# Altium schematic sheet 6_din.SchDoc: Digital Inputs
size A4; DocumentNumber: 7; SheetNumber: 7; SheetTotal: 11
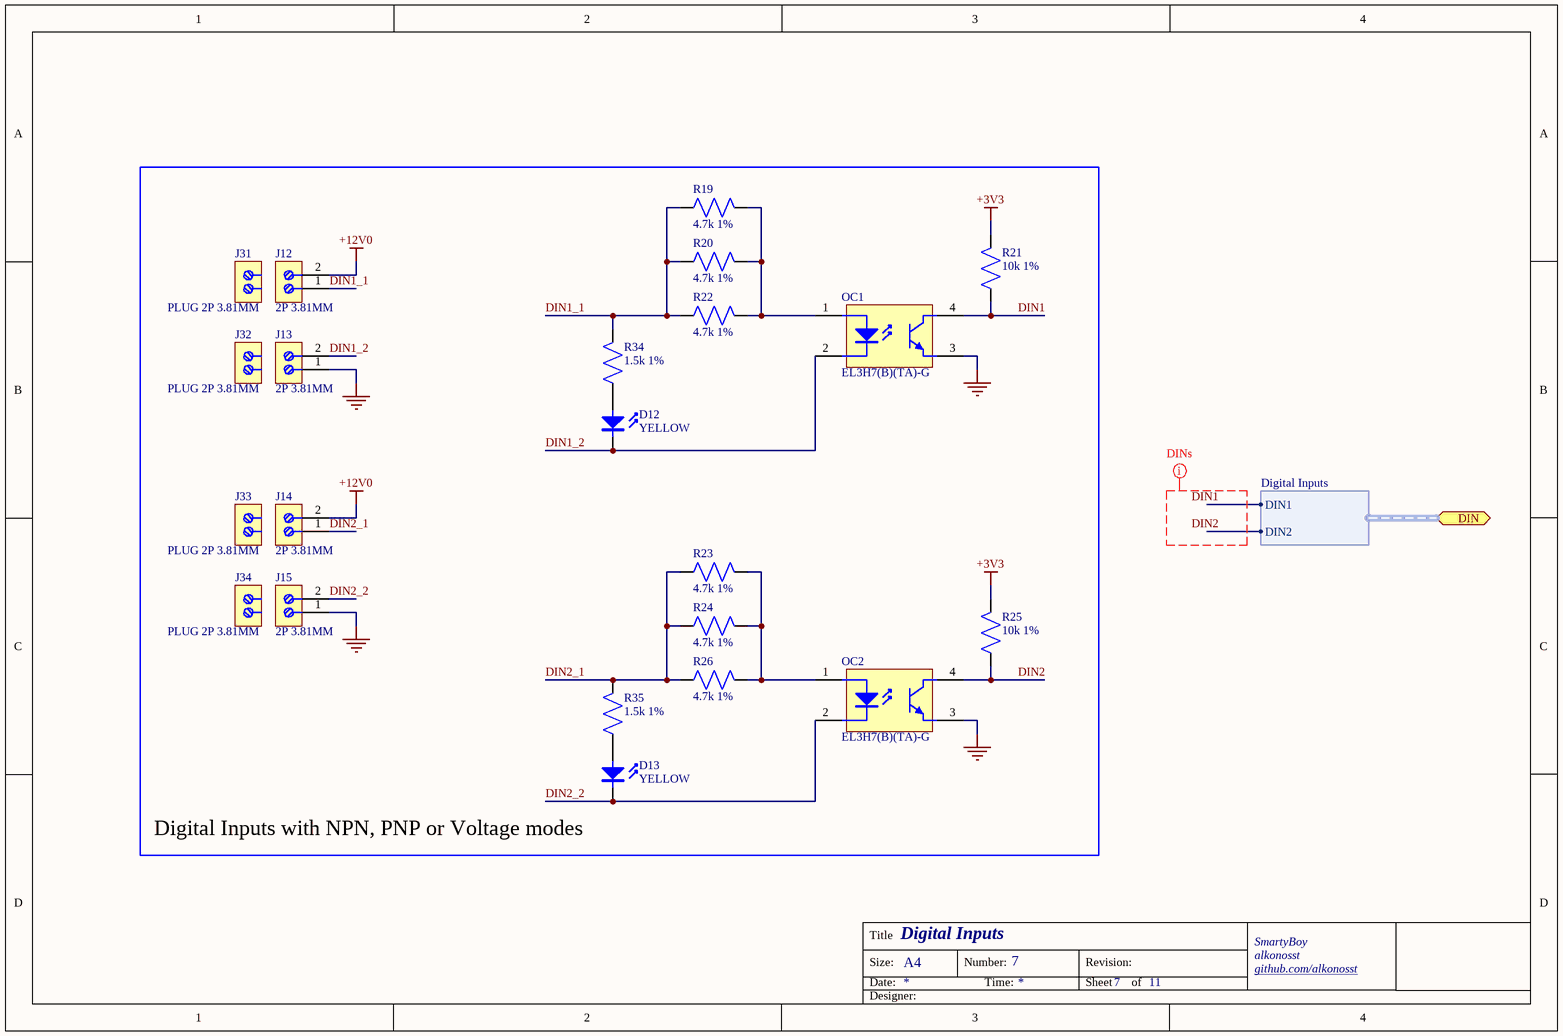
[diagram p0: 6_din.SchDoc]

## Parts
D12  YELLOW  [LED0603-YELLOW]
D13  YELLOW  [LED0603-YELLOW]
J12  2P 3.81MM  [TB-2P-3.81MM]  (no BOM)
J13  2P 3.81MM  [TB-2P-3.81MM]  (no BOM)
J14  2P 3.81MM  [TB-2P-3.81MM]  (no BOM)
J15  2P 3.81MM  [TB-2P-3.81MM]  (no BOM)
J31  PLUG 2P 3.81MM  [TB-PLUG-2P-3.81MM]  (no BOM)
J32  PLUG 2P 3.81MM  [TB-PLUG-2P-3.81MM]  (no BOM)
J33  PLUG 2P 3.81MM  [TB-PLUG-2P-3.81MM]  (no BOM)
J34  PLUG 2P 3.81MM  [TB-PLUG-2P-3.81MM]  (no BOM)
OC1  EL3H7(B)(TA)-G  [SSOP-4]
OC2  EL3H7(B)(TA)-G  [SSOP-4]
R19  4.7k 1%  [R1206]
R20  4.7k 1%  [R1206]
R21  10k 1%  [R0603]
R22  4.7k 1%  [R1206]
R23  4.7k 1%  [R1206]
R24  4.7k 1%  [R1206]
R25  10k 1%  [R0603]
R26  4.7k 1%  [R1206]
R34  1.5k 1%  [R0603]
R35  1.5k 1%  [R0603]

## Blocks framed on the sheet
Digital Inputs with NPN, PNP or Voltage modes: D12 D13 J12-J15 J31-J34 OC1 OC2 R19-R26 R34 R35

## Ports
DIN (bidir, harness Digital Inputs)

## Harnesses
Digital Inputs: DIN1, DIN2

## Nets
+3V3: R21.2 R25.2
+12V0: J12.2 J14.2
GND: J13.1 J15.1 OC1.3(E) OC2.3(E)
DIN1: OC1.4(C) R21.1 ; port DIN.DIN1
DIN1_1: J12.1 R19.1 R20.1 R22.1 R34.2
DIN1_2: D12.1 J13.2 OC1.2(K)
DIN2: OC2.4(C) R25.1 ; port DIN.DIN2
DIN2_1: J14.1 R23.1 R24.1 R26.1 R35.2
DIN2_2: D13.1 J15.2 OC2.2(K)
NetD12_2: D12.2 R34.1
NetD13_2: D13.2 R35.1
NetOC1_1: OC1.1(A) R19.2 R20.2 R22.2
NetOC2_1: OC2.1(A) R23.2 R24.2 R26.2

## Layout directives
net class DINs: DIN1, DIN2

## Notes on the sheet
- Title
- Size:
- Date:
- A4
- Number:
- Time:
- Revision:
- Sheet
- of
- SmartyBoy
- alkonosst
- github.com/alkonosst <http://github.com/alkonosst>
- Designer:

## Library data of the parts
D12 D13 = 19-213/Y2C-CQ2R2L/3T(CY): Yellow 585.5~591.5nm 0603 Light Emitting Diodes (LED); LCSC part: C72038; Category: Optoelectronics: Light Emitting Diodes (LED)
J12-J15 = TBLOCK-2P-3.81MM: Terminal Block 2 Positions 3.81MM; Category: Connectors: Pluggable System Terminal Block
J31-J34 = PLUG-2P-3.81MM: Terminal block plug 2positions 3.81mm; Category: Connectors: Pluggable System Terminal Block
OC1 OC2 = EL3H7(B)(TA)-G: 1 3750Vrms TransistorOptocouplers DC SOP-4_P1.27 Optocouplers - Phototransistor Output; LCSC part: C32565; Category: Optoelectronics: Optocouplers - Phototransistor Output
R19 R20 R22-R24 R26 = 1206W4F4701T5E: 0.25W ±1% 4.7kΩ ±100ppm/℃ 1206 Chip Resistor - Surface Mount; LCSC part: C17936; Category: Resistors: Chip Resistor - Surface Mount
R21 R25 = 0603WAF1002T5E: ±1% ±100ppm/℃ 10kΩ 0.1W 0603 Chip Resistor - Surface Mount; LCSC part: C25804; Category: Resistors: Chip Resistor - Surface Mount
R34 R35 = 0603WAF1501T5E: 1.5kΩ ±1% ±100ppm/℃ 0.1W 0603 Chip Resistor - Surface Mount; LCSC part: C22843; Category: Resistors: Chip Resistor - Surface Mount